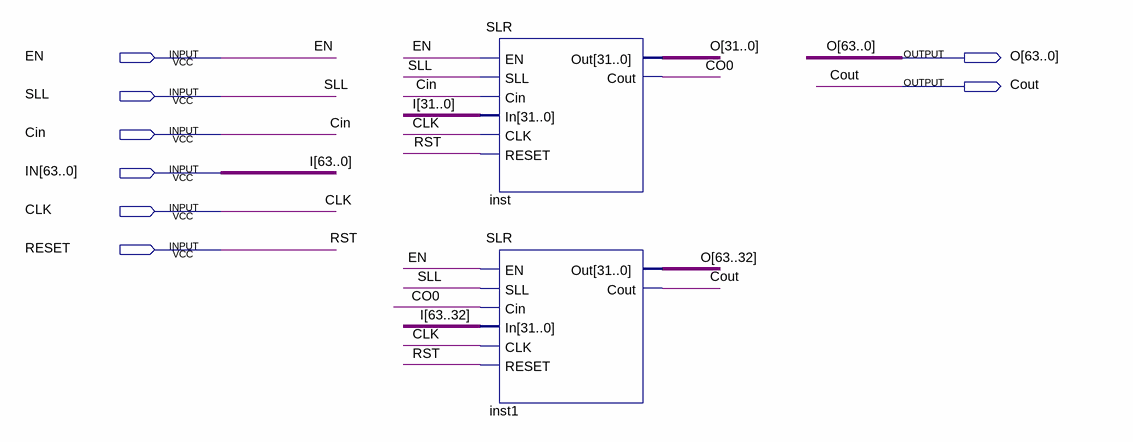
[diagram p0: schematic sheet]
// Quartus schematic SLR64Bit.bdf as structural Verilog: 2 symbols, 8 pins
module SLR64Bit (
  input  EN,
  input  SLL,
  input  Cin,
  input  [63:0] IN,
  input  CLK,
  input  RESET,
  output [63:0] O,
  output Cout
);

  wire CO0;

  SLR inst (.EN(EN), .SLL(SLL), .Cin(Cin), .In(IN[31:0]), .CLK(CLK), .RESET(RESET), .Out(O[31:0]), .Cout(CO0));
  SLR inst1 (.EN(EN), .SLL(SLL), .Cin(CO0), .In(IN[63:32]), .CLK(CLK), .RESET(RESET), .Out(O[63:32]), .Cout(Cout));

  // Other names for the same wires on the sheet: I[63:0] = IN; RST = RESET
endmodule
